# Altium schematic sheet RNG_SATA.SchDoc: RTM SATA
size 420 x 297 mm; Author: G.K.; CompanyName: WUT; DrawnBy: G.K.; Organization: CERN; Address1: Warsaw Univeristy of Technology; Address2: Nowowiejska 15/19; Revision: -; SheetNumber: -; SheetTotal: -; EDA_Number: ARTIQ; Projet: SINARA; ModifiedBy: -; CreateDate: XX/XX/XXXX; CheckedDate: -; Title2: adapter; DivGrp: ISE; Designer: G.K.; ModifiedDate: -; ProjectName: SINARA
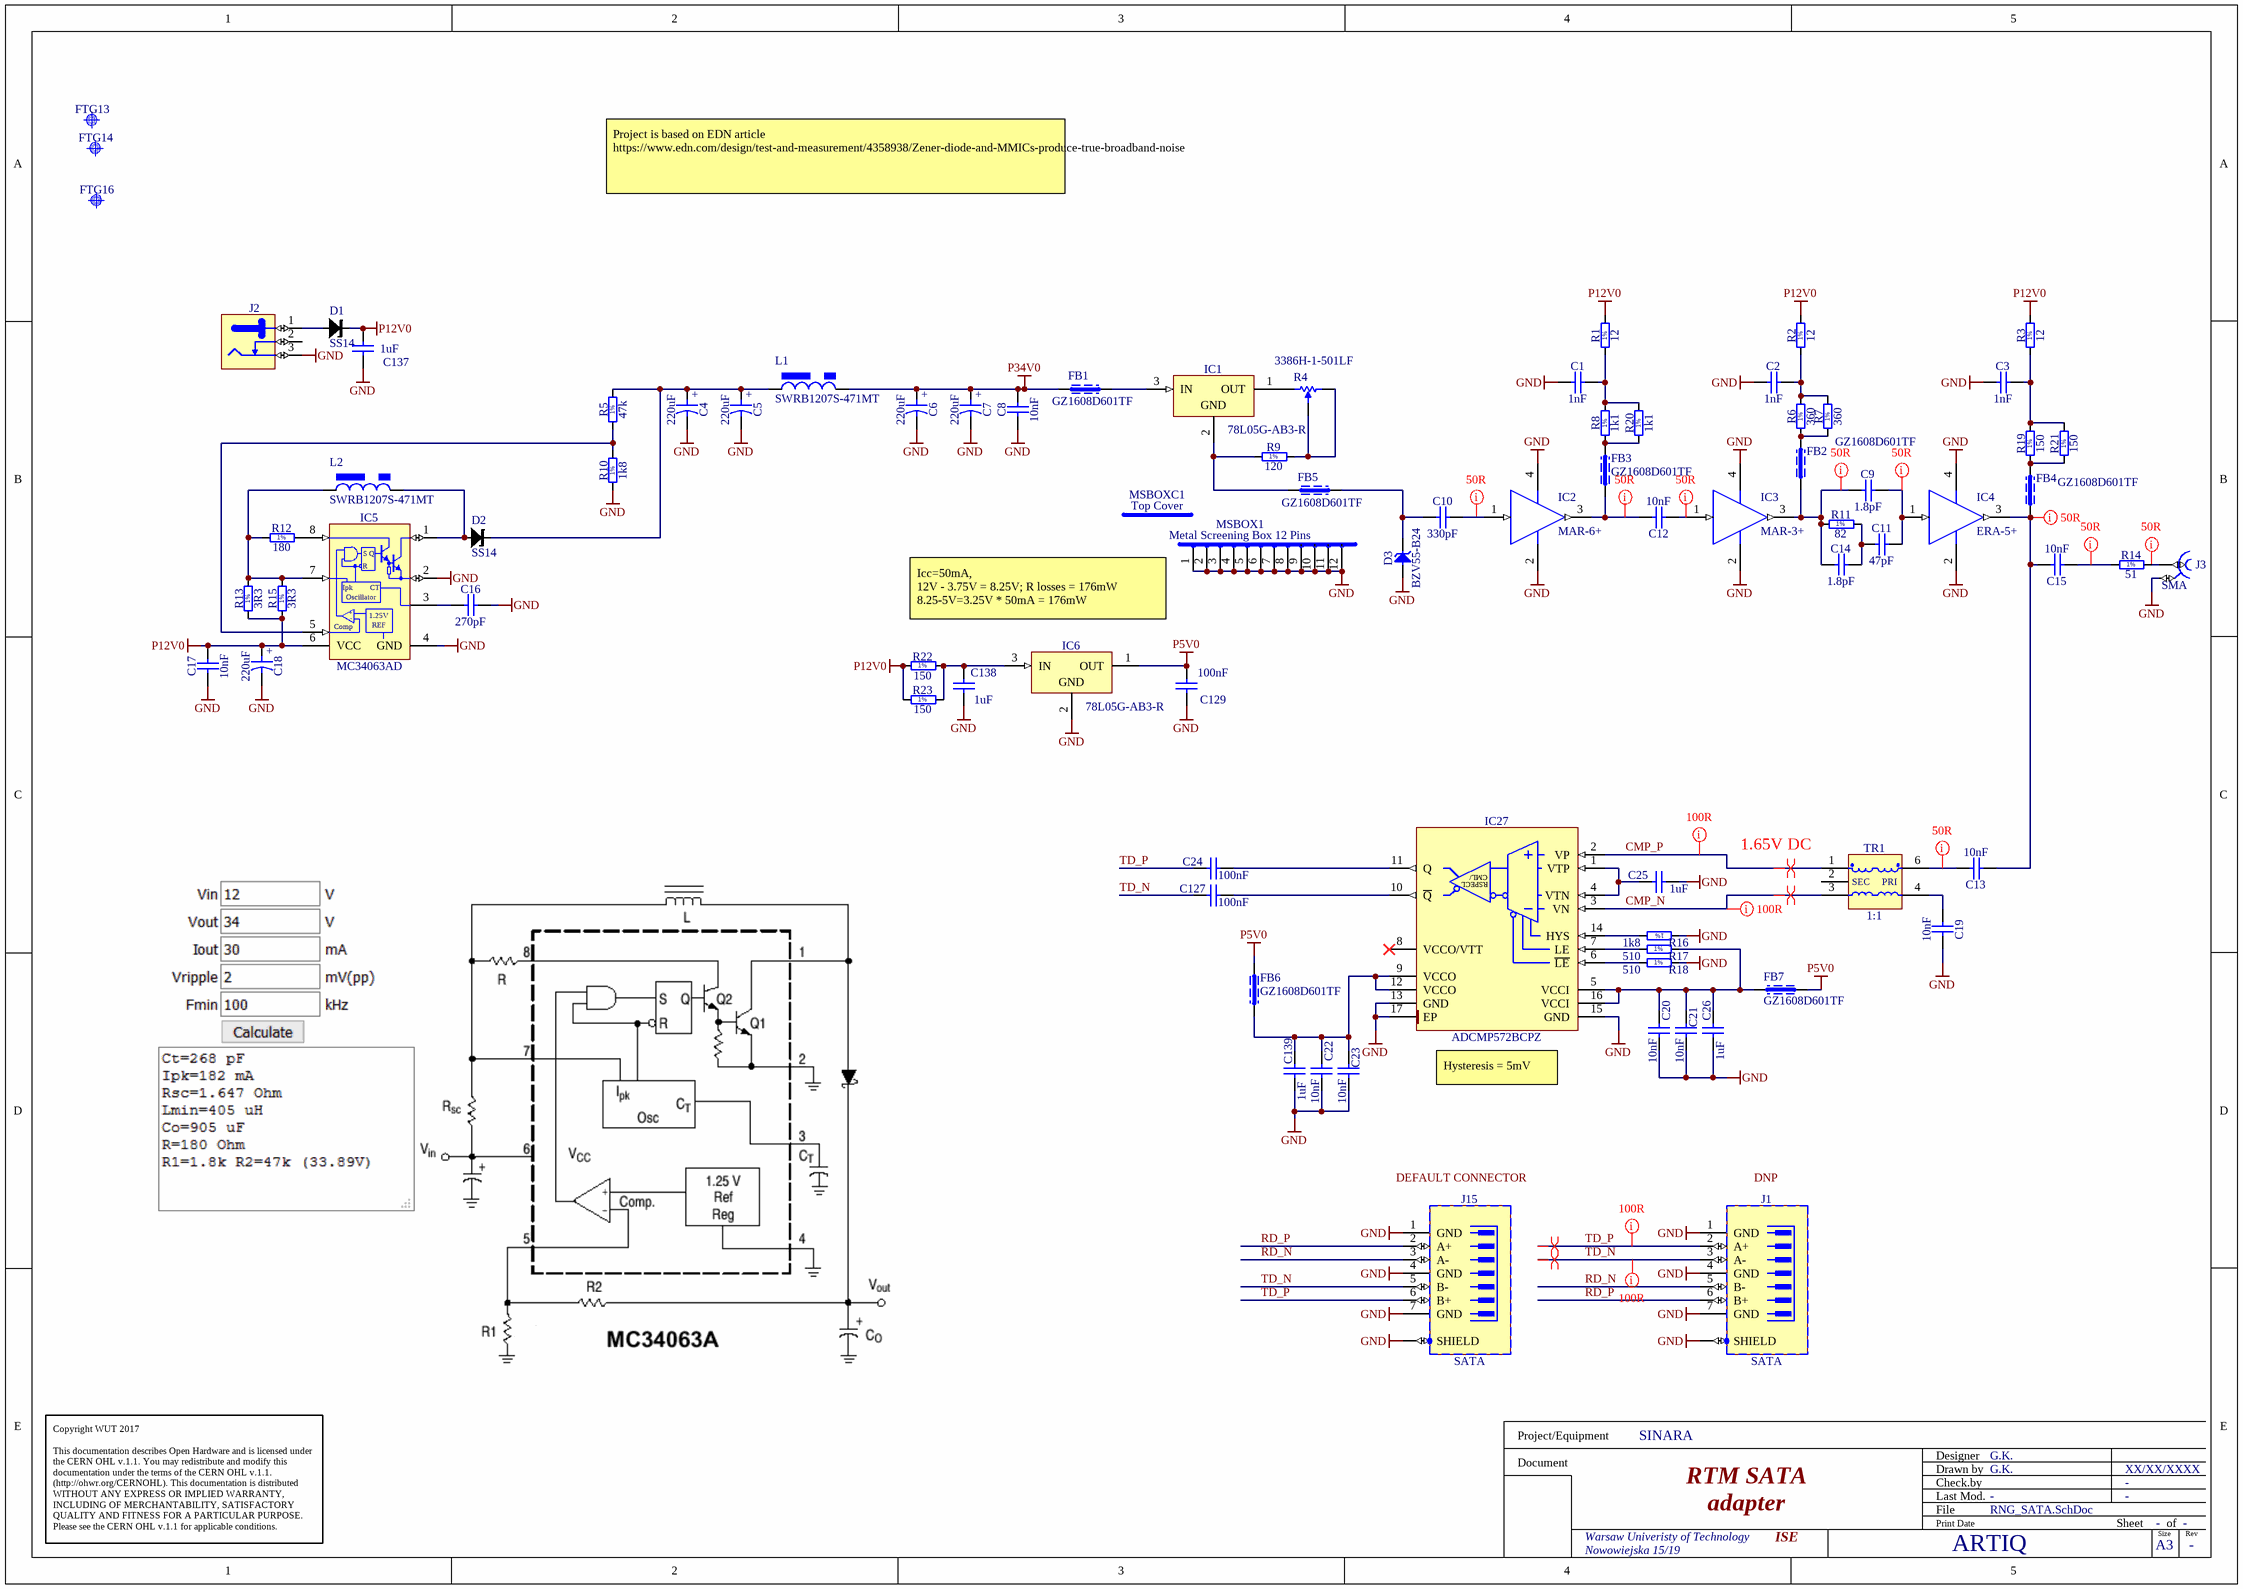
[diagram p0: RNG_SATA.SchDoc]

## Parts
C1  1nF  [CAPC1608X90N]
C2  1nF  [CAPC1608X90N]
C3  1nF  [CAPC1608X90N]
C4  220uF  [CAPAE830X1020N]
C5  220uF  [CAPAE830X1020N]
C6  220uF  [CAPAE830X1020N]
C7  220uF  [CAPAE830X1020N]
C8  10nF  [CAPC1608X87N]
C9  1.8pF  [CAPC1608X87N]
C10  330pF  [CAPC1608X87N]
C11  47pF  [CAPC1608X87N]
C12  10nF  [CAPC1608X87N]
C13  10nF  [CAPC1608X87N]
C14  1.8pF  [CAPC1608X87N]
C15  10nF  [CAPC1608X87N]
C16  270pF  [CAPC1608X87N]
C17  10nF  [CAPC1608X87N]
C18  220uF  [CAPAE830X1020N]
C19  10nF  [CAPC1608X87N]
C20  10nF  [CAPC1608X87N]
C21  10nF  [CAPC1608X87N]
C22  10nF  [CAPC1608X87N]
C23  10nF  [CAPC1608X87N]
C24  100nF  [CAPC1005X55N]
C25  1uF  [CAPC1608X87N]
C26  1uF  [CAPC1608X87N]
C127  100nF  [CAPC1005X55N]
C129  100nF  [CAPC1005X55N]
C137  1uF  [CAPC1608X87N]
C138  1uF  [CAPC1608X87N]
C139  1uF  [CAPC1608X87N]
D1  SS14  [DO-214AC/SMA]
D2  SS14  [DO-214AC/SMA]
D3  BZV55-B24  [DIOMELF3515N]
FB1  GZ1608D601TF  [0603L]
FB2  GZ1608D601TF  [0603L]
FB3  GZ1608D601TF  [0603L]
FB4  GZ1608D601TF  [0603L]
FB5  GZ1608D601TF  [0603L]
FB6  GZ1608D601TF  [0603L]
FB7  GZ1608D601TF  [0603L]
FTG13  Use only in PCB  [FIDUCIAL_TOP_C100-200]  (value not drawn)
FTG14  Use only in PCB  [FIDUCIAL_TOP_S100-200]  (value not drawn)
FTG16  Use only in PCB  [FIDUCIAL_TOP_S100-200]  (value not drawn)
IC1  78L05G-AB3-R  [SOT89]
IC2  MAR-6+  [MINI-CIRCUITS_VV105]
IC3  MAR-3+  [MINI-CIRCUITS_VV105]
IC4  ERA-5+  [MINI-CIRCUITS_VV105]
IC5  MC34063AD  [SOIC127P600X175-8N]
IC6  78L05G-AB3-R  [SOT89]
IC27  ADCMP572BCPZ  [QFN50P300X300X100-17N-S145]
J1  SATA  [3M_5607-4200-SH]
J2  Jack  [CLIFF_FC68148(DC-10A)]  (value not drawn)
J3  SMA  [RF249BT0050GHDW]
J15  SATA  [3M_5607-4200-SH]
L1  SWRB1207S-471MT  [choke_DLCSS124]
L2  SWRB1207S-471MT  [choke_DLCSS124]
MSBOX1  Metal Screening Box 12 Pins  [MSBOX_TE_2118728-2]
MSBOXC1  Top Cover  [MSBOX_TE_2118727-2]
R1  12  [RESC1608X55N]
R2  12  [RESC1608X55N]
R3  12  [RESC1608X55N]
R4  3386H-1-501LF  [BOUR-3386H]
R5  47k  [RESC1608X55N]
R6  360  [RESC2012X60N]
R7  360  [RESC2012X60N]
R8  1k1  [RESC1608X55N]
R9  120  [RESC1608X55N]
R10  1k8  [RESC1608X55N]
R11  82  [RESC1608X55N]
R12  180  [RESC1608X55N]
R13  3R3  [RESC2012X60N]
R14  51  [RESC1608X55N]
R15  3R3  [RESC2012X60N]
R16  1k8  [RESC1608X55N]
R17  510  [RESC1608X55N]
R18  510  [RESC1608X55N]
R19  150  [RESC2012X60N]
R20  1k1  [RESC1608X55N]
R21  150  [RESC2012X60N]
R22  150  [RESC2012X60N]
R23  150  [RESC2012X60N]
TR1  1:1  [XFMR_MINI-CIRCUITS_AT224]

## Nets
GND: C1.1 C2.1 C3.1 C4.2 C5.2 C6.2 C7.2 C8.1 C16.2 C17.1 C18.2 C19.2 C20.2 C21.2 C22.2 C23.2 C25.2 C26.1 C129.2 C137.1 C138.1 C139.1 D3.2(A) IC2.2(GND) IC2.4(GND) IC3.2(GND) IC3.4(GND) IC4.2(GND) IC4.4(GND) IC5.2(SWE) IC5.4(GND) IC6.2(GND) IC27.13(GND) IC27.15(GND) IC27.17(EP) J1.1(GND) J1.4(GND) J1.7(GND) J1.8(SHIELD) J2.3 J3.2 J15.1(GND) J15.4(GND) J15.7(GND) J15.8(SHIELD) MSBOX1.1 MSBOX1.2 MSBOX1.3 MSBOX1.4 MSBOX1.5 MSBOX1.6 MSBOX1.7 MSBOX1.8 MSBOX1.9 MSBOX1.10 MSBOX1.11 MSBOX1.12 R10.1 R16.1 R18.2
P5V0: C129.1 FB6.1 FB7.1 IC6.1(OUT)
P12V0: C17.2 C18.1 C137.2 D1.K IC5.6(VCC) R1.2 R2.2 R3.2 R13.1 R15.1 R22.1 R23.1
P34V0: C6.1 C7.1 C8.2 FB1.1 L1.2
CMP_N: IC27.3(VN) TR1.3(S)
CMP_P: IC27.2(VP) TR1.1(SDOT)
RD_N: J1.5(B-) J15.3(A-)
RD_P: J1.6(B+) J15.2(A+)
TD_N: C127.1 J1.3(A-) J15.5(B-)
TD_P: C24.2 J1.2(A+) J15.6(B+)
NetC1_2: C1.2 R1.1 R8.2 R20.2
NetC2_2: C2.2 R2.1 R6.2 R7.2
NetC3_2: C3.2 R3.1 R19.2 R21.2
NetC4_1: C4.1 C5.1 D2.K L1.1 R5.2
NetC9_1: C9.1 C14.1 FB2.1 IC3.3(RF_OUT) R11.1
NetC9_2: C9.2 C11.2 IC4.1(RF_IN)
NetC10_1: C10.1 D3.1(C) FB5.2
NetC10_2: C10.2 IC2.1(RF_IN)
NetC11_1: C11.1 C14.2 R11.2
NetC12_1: C12.1 IC3.1(RF_IN)
NetC12_2: C12.2 FB3.1 IC2.3(RF_OUT)
NetC13_1: C13.1 C15.2 FB4.1 IC4.3(RF_OUT)
NetC13_2: C13.2 TR1.6(PDOT)
NetC15_1: C15.1 R14.1
NetC16_1: C16.1 IC5.3(TC)
NetC19_1: C19.1 TR1.4(P)
NetC20_1: C20.1 C21.1 C26.2 FB7.2 IC27.5(VCCI) IC27.16(VCCI) R17.2
NetC22_1: C22.1 C23.1 C139.2 FB6.2 IC27.9(VCCO) IC27.12(VCCO)
NetC24_1: C24.1 IC27.11(Q)
NetC25_1: C25.1 IC27.1(VTP) IC27.4(VTN)
NetC127_2: C127.2 IC27.10(~{Q})
NetC138_2: C138.2 IC6.3(IN) R22.2 R23.2
NetD1_A: D1.A J2.1
NetD2_A: D2.A IC5.1(SWC) L2.2
NetFB1_2: FB1.2 IC1.3(IN)
NetFB2_2: FB2.2 R6.1 R7.1
NetFB3_2: FB3.2 R8.1 R20.1
NetFB4_2: FB4.2 R19.1 R21.1
NetFB5_1: FB5.1 IC1.2(GND) R9.1
NetIC1_1: IC1.1(OUT) R4.1
NetIC5_5: IC5.5(COMP) R5.1 R10.2
NetIC5_7: IC5.7(Ipk) L2.1 R12.1 R13.2 R15.2
NetIC5_8: IC5.8(DRVC) R12.2
NetIC27_6: IC27.6(~{LE}) R18.1
NetIC27_7: IC27.7(LE) R17.1
NetIC27_14: IC27.14(HYS) R16.2
NetJ3_1: J3.1 R14.2
NetR4_2: R4.2 R4.3 R9.2

Not connected (* = marked no-connect by the designer): IC27 8(VCCO/VTT)*; J2 2; TR1 2(NC)

## Layout directives
net class Z50R: NetC9_1, NetC9_2, NetC10_2, NetC12_1, NetC12_2, NetC13_1, NetC13_2, NetC15_1, NetJ3_1
net class Z100R: CMP_N, CMP_P, TD_N, TD_P
differential pair: CMP_N, CMP_P, TD_N, TD_P

## Notes on the sheet
- Project is based on EDN article
  https://www.edn.com/design/test-and-measurement/4358938/Zener-diode-and-MMICs-produce-true-broadband-noise
- Icc=50mA,
  12V - 3.75V = 8.25V; R losses = 176mW
  8.25-5V=3.25V * 50mA = 176mW
- (near TR1) 1.65V DC
- (near IC27) Hysteresis = 5mV
- Copyright WUT 2017
  This documentation describes Open Hardware and is licensed under the CERN OHL v.1.1. You may redistribute and modify this documentation under the terms of the CERN OHL v.1.1. (http://ohwr.org/CERNOHL). This documentation is distributed WITHOUT ANY EXPRESS OR IMPLIED WARRANTY, INCLUDING OF MERCHANTABILITY, SATISFACTORY QUALITY AND FITNESS FOR A PARTICULAR PURPOSE. Please see the CERN OHL v.1.1 for applicable conditions.
- Labels drawn without touching a wire or pin: DEFAULT CONNECTOR, DNP
- Project/Equipment
- Document
- Designer
- Drawn by
- Check.by
- File
- Last Mod.
- Print Date
- Sheet
- Size
- A3
- of
- Rev
- (in symbol ADCMP573BCPZ) CML/; RSPECL
- (in symbol CAE830-1020_220UF_35V_20%) +
- (in symbol MC34063AD) S; Q; R; CT; Oscillator; +; -; 1.25V; Comp; REF
- (in symbol R0603_1K1_1%_0.1W_100PPM) 1%
- (in symbol R0603_1K8_1%_0.1W_100PPM) 1%
- (in symbol R0603_12R_1%_0.1W_100PPM) 1%
- (in symbol R0603_47K_1%_0.1W_100PPM) 1%
- (in symbol R0603_51R_1%_0.1W_100PPM) 1%
- (in symbol R0603_82R_1%_0.1W_100PPM) 1%
- (in symbol R0603_120R_1%_0.1W_100PPM) 1%
- (in symbol R0603_180R_1%_0.1W_100PPM) 1%
- (in symbol R0603_510R_1%_0.1W_100PPM) 1%
- (in symbol R0805_3R3_1%_0.125W_200PPM) 1%
- (in symbol R0805_150R_1%_0.125W_100PPM) 1%
- (in symbol R0805_360R_1%_0.125W_100PPM) 1%
- (in symbol XFMR_MINI-CIRCUITS_TC1-1-13M+) SEC; PRI

## Library data of the parts
C1-C3 = CC0603_1NF_50V_1%_NP0: Non-polarised capacitor; Part Description: SMD Multilayer Chip Ceramic Capacitor; Manufacturer: GENERIC; Manufacturer1 Part Number: 06035A102FAT2A; Voltage: 50V; TC: C0G/NP0; Tolerance: ±1%; Part Number: CC0603_1NF_50V_1%_NP0; Component Kind: Standard; Component Type: Standard; Pin Count: 2; Value: 1nF; Status: None; Manufacturer Part Number: CC0603_1NF_50V_1%_NP0; Case: 0603; Mounted: Yes; Socket: No; SMD: Yes; Sense: No; Manufacturer1 Example: AVX; Manufacturer1 ComponentHeight: 0.9mm; HelpURL: \\cern.ch\dfs\Applications\Altium\Datasheets\CC0603_C0G_AVX.pdf; Author: CERN DEM JLC; CreateDate: 15.06.2017; LatestRevisionDate: 15.06.2017
C4-C7 C18 = CAE830-1020_220UF_35V_20%: Polarised capacitor; Part Description: Aluminum Electrolytic SMT Capacitor; Manufacturer: PANASONIC; Manufacturer Part Number: EEEFK1V221AP; Voltage: 35V; Tolerance: ±20%; Part Number: CAE830-1020_220UF_35V_20%; Component Kind: Standard; Component Type: Standard; Pin Count: 2; Value: 220uF; Status: Not Recommended; Case: F; Mounted: Yes; Socket: No; SMD: Yes; Sense: No; ComponentHeight: 10.2mm; HelpURL: \\cern.ch\dfs\Applications\Altium\Datasheets\CAE_PANASONIC_FK.pdf; Author: CERN DEM JLC; CreateDate: 03.12.2007; LatestRevisionDate: 05.11.2014
C8 C12 C13 C15 C17 C19-C23 = CC0603_10NF_50V_5%_C0G: Non-polarised capacitor; Part Description: SMD Multilayer Chip Ceramic Capacitor; Manufacturer: GENERIC; Manufacturer1 Part Number: C1608C0G1H103J080AA; Voltage: 50V; TC: C0G/NP0; Tolerance: ±5%; Part Number: CC0603_10NF_50V_5%_C0G; Component Kind: Standard; Component Type: Standard; Pin Count: 2; Value: 10nF; Status: Preferred; Manufacturer Part Number: CC0603_10NF_50V_5%_C0G; Case: 0603; Mounted: Yes; Socket: No; SMD: Yes; Sense: No; Manufacturer1 Example: TDK; Manufacturer1 ComponentHeight: 0.9mm; HelpURL: \\cern.ch\dfs\Applications\Altium\Datasheets\CC0603_C0G_TDK_C.pdf; Author: CERN DEM JLC; CreateDate: 10.12.2014; LatestRevisionDate: 10.12.2014
C9 C14 = CC0603_1.8PF_50V_0.25PF_NP0: Non-polarised capacitor; Part Description: SMD Multilayer Chip Ceramic Capacitor; Manufacturer: GENERIC; Manufacturer1 Part Number: 223886715188; Voltage: 50V; TC: C0G/NP0; Tolerance: ±0.25pF; Part Number: CC0603_1.8PF_50V_0.25PF_NP0; Component Kind: Standard; Component Type: Standard; Pin Count: 2; Value: 1.8pF; Status: Preferred; Manufacturer Part Number: CC0603_1.8PF_50V_0.25PF_NP0; Case: 0603; Mounted: Yes; Socket: No; SMD: Yes; Sense: No; Manufacturer1 Example: PHYCOMP; Manufacturer1 ComponentHeight: 0.87mm; HelpURL: \\cern.ch\dfs\Applications\Altium\Datasheets\CC0603_NP0_PHYCOMP.pdf; Author: CERN DEM JLC; CreateDate: 03.12.2007; LatestRevisionDate: 03.12.2007
C10 = CC0603_330PF_50V_5%_NP0: Non-polarised capacitor; Part Description: SMD Multilayer Chip Ceramic Capacitor; Manufacturer: GENERIC; Manufacturer1 Part Number: 223886715331; Voltage: 50V; TC: C0G/NP0; Tolerance: ±5%; Part Number: CC0603_330PF_50V_5%_NP0; Component Kind: Standard; Component Type: Standard; Pin Count: 2; Value: 330pF; Status: Preferred; Manufacturer Part Number: CC0603_330PF_50V_5%_NP0; Case: 0603; Mounted: Yes; Socket: No; SMD: Yes; Sense: No; Manufacturer1 Example: PHYCOMP; Manufacturer1 ComponentHeight: 0.87mm; HelpURL: \\cern.ch\dfs\Applications\Altium\Datasheets\CC0603_NP0_PHYCOMP.pdf; Author: CERN DEM JLC; CreateDate: 03.12.2007; LatestRevisionDate: 03.12.2007
C11 = CC0603_47PF_50V_5%_NP0: Non-polarised capacitor; Part Description: SMD Multilayer Chip Ceramic Capacitor; Manufacturer: GENERIC; Manufacturer1 Part Number: 223886715479; Voltage: 50V; TC: C0G/NP0; Tolerance: ±5%; Part Number: CC0603_47PF_50V_5%_NP0; Component Kind: Standard; Component Type: Standard; Pin Count: 2; Value: 47pF; Status: Preferred; Manufacturer Part Number: CC0603_47PF_50V_5%_NP0; Case: 0603; Mounted: Yes; Socket: No; SMD: Yes; Sense: No; Manufacturer1 Example: PHYCOMP; Manufacturer1 ComponentHeight: 0.87mm; HelpURL: \\cern.ch\dfs\Applications\Altium\Datasheets\CC0603_NP0_PHYCOMP.pdf; Author: CERN DEM JLC; CreateDate: 03.12.2007; LatestRevisionDate: 03.12.2007
C16 = CC0603_270PF_50V_5%_NP0: Non-polarised capacitor; Part Description: SMD Multilayer Chip Ceramic Capacitor; Manufacturer: GENERIC; Manufacturer1 Part Number: 223886715271; Voltage: 50V; TC: C0G/NP0; Tolerance: ±5%; Part Number: CC0603_270PF_50V_5%_NP0; Component Kind: Standard; Component Type: Standard; Pin Count: 2; Value: 270pF; Status: Preferred; Manufacturer Part Number: CC0603_270PF_50V_5%_NP0; Case: 0603; Mounted: Yes; Socket: No; SMD: Yes; Sense: No; Manufacturer1 Example: PHYCOMP; Manufacturer1 ComponentHeight: 0.87mm; HelpURL: \\cern.ch\dfs\Applications\Altium\Datasheets\CC0603_NP0_PHYCOMP.pdf; Author: CERN DEM JLC; CreateDate: 03.12.2007; LatestRevisionDate: 03.12.2007
C24 C127 C129 = CC0402_100NF_16V_10%_X7R: Non-polarised capacitor; Part Description: SMD Multilayer Chip Ceramic Capacitor; Manufacturer: GENERIC; Manufacturer1 Part Number: GRM155R71C104KA88D; Voltage: 16V; TC: X7R; Tolerance: ±10%; Table: Capacitors SMD; Part Number: CC0402_100NF_16V_10%_X7R; Component Kind: Standard; Component Type: Standard; Pin Count: 2; Value: 100nF; Status: Not Recommended; Manufacturer Part Number: CC0402_100NF_16V_10%_X7R; Case: 0402; Mounted: Yes; Socket: No; SMD: Yes; Manufacturer1 Example: MURATA; Manufacturer1 ComponentHeight: 0.55mm; HelpURL: \\cern.ch\dfs\Applications\Altium\Datasheets\CC0402_X7R_MURATA_GRM.pdf; Author: CERN DEM JLC; CreateDate: 05/12/2013; LatestRevisionDate: 03/12/2007
C25 C26 C137-C139 = CC0603_1UF_16V_10%_X7R: Non-polarised capacitor; Part Description: SMD Multilayer Chip Ceramic Capacitor; Manufacturer: GENERIC; Manufacturer1 Part Number: 223824613663; Voltage: 16V; TC: X7R; Tolerance: ±10%; Table: Capacitors SMD; Part Number: CC0603_1UF_16V_10%_X7R; Component Kind: Standard; Component Type: Standard; Pin Count: 2; Value: 1uF; Status: Preferred; Manufacturer Part Number: CC0603_1uF_16V_10%_X7R; Case: 0603; Mounted: Yes; Socket: No; SMD: Yes; Manufacturer1 Example: PHYCOMP; Manufacturer1 ComponentHeight: 0.87mm; HelpURL: \\cern.ch\dfs\Applications\Altium\Datasheets\CC0805_X5R_PHYCOMP_HC.pdf; Author: CERN DEM JLC; CreateDate: 03/12/2007; LatestRevisionDate: 03/12/2007
D1 D2 = D_SS14: 1A 80V shottky diode (Maritex); Supplier 1: Digi-Key; Supplier Part Number 1: SS14-E3/5ATGITR-ND
D3 = BZV55-B24: Zener Diode; Part Description: Voltage Regulator Diode; Manufacturer: NEXPERIA; Voltage: 24V; Power: 500mW; PressFit: No; Bonding: No; Part Number: BZV55-B24; Component Kind: Standard; Component Type: Standard; Device: BZV55-B24; PackageDescription: SOD80C, MELF Diode, 2-Leads, Body 3.5x1.5mm, IPC Medium Density; Manufacturer Part Number: BZV55-B24; Pin Count: 2; Case: SOD-80C; Mounted: Yes; Socket: No; SMD: Yes; Sense: No; ComponentHeight: 1.6mm; HelpURL: \\cern.ch\dfs\Applications\Altium\Datasheets\BZV55.pdf; Author: CERN DEM JLC; CreateDate: 15.10.2008; LatestRevisionDate: 22.01.2018
FB1-FB7 = L_FERRITE_BEAD_0603: ferrite bead 100R@100MHz 1A; Supplier 1: Newark; Supplier Part Number 1: 89R3144
FTG13 = FIDUCIAL_TARGET_C100-200: Fiducial Target; Part Description: Round Fiducial Target, Top Layer, 1.0mm, Top Solder 2.0mm, Keepout =2.0mm; Mounted: No; Part Number: FIDUCIAL_TARGET_C100-200; Component Kind: Standard (No BOM); Component Type: Standard (No BOM); Pin Count: 1; Family: Fiducial; Socket: No; SMD: Yes; Sense: No; Status: None; ComponentHeight: 0mm; HelpURL: Undefined; Author: CERN DEM JLC; CreateDate: 09.02.2010; LatestRevisionDate: 04.04.2012; PackageDescription: Round Fiducial Target, Top Layer, 1.0mm, Top Solder 2.0mm, Keepout =2.0mm
FTG14 FTG16 = FIDUCIAL_TARGET_S100-200: Fiducial Target; Part Description: Square Fiducial Target, Top Layer, 1.0mm, Top Solder 2.0mm, Keepout =2.0mm; Mounted: No; Part Number: FIDUCIAL_TARGET_S100-200; Component Kind: Standard (No BOM); Component Type: Standard (No BOM); Pin Count: 1; Family: Fiducial; Socket: No; SMD: Yes; Sense: No; Status: None; ComponentHeight: 0mm; HelpURL: Undefined; Author: CERN DEM JLC; CreateDate: 09.02.2010; LatestRevisionDate: 04.04.2012; PackageDescription: Square Fiducial Target, Top Layer, 1.0mm, Top Solder 2.0mm, Keepout =2.0mm
IC1 IC6 = L78L05ACUTR: 3-Terminal Regulator 1=OUT 2=GND 3=IN; Part Description: 5V 100mA Positive Voltage Regulator; Manufacturer: ST MICROELECTRONICS; PressFit: No; Bonding: No; Part Number: L78L05ACUTR; Component Kind: Standard; Component Type: Standard; Device: L78L05ACUTR; PackageDescription: SOT89-3, 3-Leads, Body 2.44x4.5mm; Manufacturer Part Number: L78L05ACUTR; Pin Count: 4; Case: SOT89; Mounted: Yes; Socket: No; SMD: Yes; Sense: No; ComponentHeight: 1.6mm; HelpURL: \\cern.ch\dfs\Applications\Altium\Datasheets\L78L05ACUTR.pdf; Author: CERN DEM JLC; CreateDate: 10.10.2011; LatestRevisionDate: 06.12.2011
IC2 = RF_MAR-6+: Monolithic Amplifier DC-2GHz; Part Description: DC-2GHz Monolithic Amplifier; Manufacturer: MINI-CIRCUITS; PressFit: No; Bonding: No; Part Number: MAR-6+; Component Kind: Standard; Component Type: Standard; Device: MAR-6+; PackageDescription: MINI-CIRCUITS VV105 Case, Body 2.16mm Diameter X 1.22mm H; Manufacturer Part Number: MAR-6+; Pin Count: 4; Mounted: Yes; Socket: No; SMD: Yes; Sense: No; ComponentHeight: 1.22mm; Author: CERN DEM MR; HelpURL: \\cern.ch\dfs\Applications\Altium\Datasheets\ERA-3+.pdf; CreateDate: 02.10.2017; LatestRevisionDate: 02.10.2017
IC3 = RF_MAR-3+: Monolithic Amplifier DC-2GHz; Part Description: DC-2GHz Monolithic Amplifier; Manufacturer: MINI-CIRCUITS; PressFit: No; Bonding: No; Part Number: MAR-3+; Component Kind: Standard; Component Type: Standard; Device: MAR-3+; PackageDescription: MINI-CIRCUITS VV105 Case, Body 2.16mm Diameter X 1.22mm H; Manufacturer Part Number: MAR-3+; Pin Count: 4; Mounted: Yes; Socket: No; SMD: Yes; Sense: No; ComponentHeight: 1.22mm; Author: CERN DEM MR; HelpURL: \\cern.ch\dfs\Applications\Altium\Datasheets\ERA-3+.pdf; CreateDate: 02.10.2017; LatestRevisionDate: 02.10.2017
IC4 = RF_ERA-5+: Monolithic Amplifier DC-4GHz; Part Description: DC-4GHz Monolithic Amplifier; Manufacturer: MINI-CIRCUITS; PressFit: No; Bonding: No; Part Number: ERA-5+; Component Kind: Standard; Component Type: Standard; Device: ERA-5+; PackageDescription: MINI-CIRCUITS VV105 Case, Body 2.16mm Diameter X 1.22mm H; Manufacturer Part Number: ERA-5+; Pin Count: 4; Mounted: Yes; Socket: No; SMD: Yes; Sense: No; ComponentHeight: 1.22mm; Author: CERN DEM MR; HelpURL: \\cern.ch\dfs\Applications\Altium\Datasheets\ERA-3+.pdf; CreateDate: 02.10.2017; LatestRevisionDate: 02.10.2017
IC5 = MC34063AD: 3V to 40V 1.5A Peak Boost/Buck/Inverting Switching Regulator; Manufacturer: TEXAS INSTRUMENTS; PressFit: No; Bonding: No; Part Number: MC34063AD; Component Kind: Standard; Component Type: Standard; Device: MC34063AD; PackageDescription: SOIC 8, Pitch 1.27mm, Body 4x5mm, IPC Medium Density; Part Description: 3V to 40V 1.5A Peak Boost/Buck/Inverting Switching Regulator; Manufacturer Part Number: MC34063AD; Pin Count: 8; Case: SOIC8; Mounted: Yes; Socket: No; SMD: Yes; Sense: No; ComponentHeight: 1.75mm; HelpURL: \\cern.ch\dfs\Applications\Altium\Datasheets\MC34063AD.pdf; Author: CERN DEM JLC; CreateDate: 27.10.2009; LatestRevisionDate: 27.10.2009
IC27 = ADCMP573BCPZ: Ultrafast 3.3V/5V Single-Supply SiGe Comparator; Manufacturer: ANALOG DEVICES; Table: Operational Amplifiers; Part Number: ADCMP572BCPZ; Component Kind: Standard; Component Type: Standard; Device: ADCMP572BCPZ; PackageDescription: QFN,0.50mm Pitch, Square; 4 Pin X 4 Pin, 3mm X 3mm X 1.00mm H Body (w/Thermal Tab 1.45 X 1.45mm), IPC Medium Density; Part Description: Ultrafast 3.3V/5V Single-Supply SiGe Comparator; Manufacturer Part Number: ADCMP572BCPZ; Pin Count: 17; Case: QFN16; Mounted: Yes; Socket: No; SMD: Yes; ComponentHeight: 1.0mm; Author: CERN DEM JLC; HelpURL: \\cern.ch\dfs\Applications\Altium\Datasheets\ADCMP573BCPZ.pdf; CreateDate: 17/07/2014; LatestRevisionDate: 18/07/2014
J1 J15 = 3M_5607-4200-SH: 7 Pin + 1 Shield SATA Receptacle; Part Description: Signal Plug, Surfacemount, Right Angle,  Serial Advanced Technology Attachment (SATA) Connector, 5607 Series; Manufacturer: 3M; PressFit: No; Part Number: 3M_5607-4200-SH; Component Kind: Standard; Component Type: Standard; Pin Count: 8; Family: SATA; Mounted: Yes; Socket: No; SMD: Yes; Sense: No; Status: None; Manufacturer Part Number: 5607-4200-SH; ComponentHeight: 4mm; HelpURL: \\cern.ch\dfs\Applications\Altium\Datasheets\3M_5607-4200-SH.pdf; Author: CERN DEM JLC; CreateDate: 14.02.2011; LatestRevisionDate: 31.05.2011
J2 = CLIFF_FC68148(DC-10A): 12V /  5A, 2.1mm Diameter Pin, DC Power Socket With  Switch. DC10A Type; Part Description: 12V/5A, 2.1mm Diameter Pin, DC Power Socket With  Switch (DC10A Type); Manufacturer: CLIFF ELECTRONIC COMPONENTS; PressFit: No; Part Number: CLIFF_FC68148(DC-10A); Component Kind: Standard; Component Type: Standard; Pin Count: 3; Family: Jack; Mounted: Yes; Socket: No; SMD: No; Sense: No; Status: None; Manufacturer Part Number: FC68148 (DC-10A); ComponentHeight: 11mm; HelpURL: \\cern.ch\dfs\Applications\Altium\Datasheets\CLIFF_FC68148(DC-10A).pdf; Author: CERN DEM JLC; CreateDate: 23.11.2010; LatestRevisionDate: 23.11.2010
J3 = CON_SMA_RF249BT0050GHDW: 50 Ohm Through Hole SMA Right Angle PCB Jack; Part Number: AdamTech_RF249BT0050GHDW; Manufacturer: AdamTech; PressFit: No; Component Kind: Standard; Component Type: Standard; Pin Count: 5; Family: SMA; Mounted: Yes; Socket: No; SMD: No; Sense: No; Status: None; Part Description: 50 Ohm Through Hole SMA Right Angle PCB Jack; Manufacturer Part Number: RF249BT0050GHDW; ComponentHeight: 10.44mm; HelpURL: \\cern.ch\dfs\Applications\Altium\Datasheets\AMPHENOL_132203.pdf; Author: GK; CreateDate: 06.10.2016; LatestRevisionDate: 06.10.2016
L1 L2 = L_POWER_CSS124: inductor; Supplier 1: Farnell; Supplier Part Number 1: 1864453
MSBOX1 = SH_TE_2118728-2: Part Description: Frame of Standard Surface Mount Shield (Two Piece), External Dimensions 16.5 x 16.5mm; Manufacturer: Tyco Electronics; Manufacturer Part Number: BMI-S-202-F; PressFit: No; Part Number: MSBOX_TE_2118728-2; Component Kind: Standard; Component Type: Standard; Pin Count: 12; PackageDescription: Frame of Standard Surface Mount Shield (Two Piece), External Dimensions 16.5 x 16.5mm; Mounted: Yes; Socket: No; SMD: Yes; Sense: No; Status: None; ComponentHeight: 7; HelpURL: \\cern.ch\dfs\Applications\Altium\Datasheets\MSBOX_LAIRD_BMI-S-202-F.pdf; Author: GK; CreateDate: 15.06.2017; LatestRevisionDate: 15.06.2017
MSBOXC1 = SH_TE_2118727-2: Metal Screening Box - Top Cover 0 Pin; Part Description: Cover for Frame of Standard Surface Mount Shield (Two Piece), External Dimensions 16.5 x 16.5mm; Manufacturer: Tyco Electronics; PressFit: No; Part Number: MSBOX_TE_2118727-2; Component Kind: Standard; Component Type: Standard; Pin Count: 0; PackageDescription: Cover for Frame of Standard Surface Mount Shield (Two Piece), External Dimensions 16.5 x 16.5mm; Mounted: Yes; Socket: No; SMD: Yes; Sense: No; Status: None; Manufacturer Part Number: 2118727-2; ComponentHeight: 2mm; HelpURL: \\cern.ch\dfs\Applications\Altium\Datasheets\MSBOX_LAIRD_BMI-S-202-C.pdf; Author: GK; CreateDate: 15.06.2017; LatestRevisionDate: 15.06.2017
R1-R3 = R0603_12R_1%_0.1W_100PPM: Resistor - 1%; Part Description: General Purpose Thick Film Chip Resistor; Manufacturer: GENERIC; Manufacturer1 Part Number: NRC06F12R0TRF; Power: 0.1W; TC: ±100ppm/°C; PressFit: No; Part Number: R0603_12R_1%_0.1W_100PPM; Component Kind: Standard; Component Type: Standard; Pin Count: 2; Value: 12; Status: Preferred; Tolerance: ±1%; Manufacturer Part Number: R0603_12R_1%_0.1W_100PPM; Case: 0603; Mounted: Yes; Sense: No; Socket: No; SMD: Yes; Manufacturer1 Example: NIC COMPONENT; Manufacturer1 ComponentHeight: 0.55mm; HelpURL: \\cern.ch\dfs\Applications\Altium\Datasheets\R0603_NIC_NRC.pdf; Author: CERN DEM JLC; CreateDate: 03.12.2007; LatestRevisionDate: 13.03.2008
R4 = CMP-2000-05591-1: Square Trimpot(R) Trimming Potentiometer, 500 Ohm, +/- 10%, 0.5 W, -55 to 125 degC, 3-Pin THD, RoHS, Tube; Manufacturer: Bourns; Product Weight: 0.85g; Resistance Value: 500Ohm; Shaft Diameter: 3.15mm; Number of Turns: 1(Elec),1(Mech)Turns; Power Rating: 0.5(1/2)W; Linear Or Logarithmic: Lin; COO: CR; Temperature Coefficient: 100ppm/C; Package Reference: 3386H; Datasheet Version: 05/2016; Dimension: 9.53x4.83x9.53mm; Military Standard: N/R; Failure Rate: N/R; Mounting: ThroughHole; Supplier: Bourns; Termination Style: Pin; Tolerance: 10%; Package Description: 3-Pin Through Hole Device, Body 9.53 x 4.83 mm, Pitch 2.54 mm; Part No: 3386H-1-501LF; Type: Trimmer; Packaging: Tube; Family: 3386; Technology: Cermet; Operating Temperature: -55to125C; Mounting Technology: ThroughHole; Supplier Standard Pack: 50; RoHS: Yes; Manufacturer URL: http://www.bourns.com/; Datasheet URL: http://www.bourns.com/docs/Product-Datasheets/3386.pdf; HTS: 8533408050; ECCN: EAR99
R5 = R0603_47K_1%_0.1W_100PPM: Resistor - 1%; Part Description: General Purpose Thick Film Chip Resistor; Manufacturer: GENERIC; Manufacturer1 Part Number: NRC06F4702TRF; Power: 0.1W; TC: ±100ppm/°C; PressFit: No; Part Number: R0603_47K_1%_0.1W_100PPM; Component Kind: Standard; Component Type: Standard; Pin Count: 2; Value: 47k; Status: Preferred; Tolerance: ±1%; Manufacturer Part Number: R0603_47K_1%_0.1W_100PPM; Case: 0603; Mounted: Yes; Sense: No; Socket: No; SMD: Yes; Manufacturer1 Example: NIC COMPONENT; Manufacturer1 ComponentHeight: 0.55mm; HelpURL: \\cern.ch\dfs\Applications\Altium\Datasheets\R0603_NIC_NRC.pdf; Author: CERN DEM JLC; CreateDate: 03.12.2007; LatestRevisionDate: 13.03.2008
R6 R7 = R0805_360R_1%_0.125W_100PPM: Resistor - 1%; Part Description: General Purpose Thick Film Chip Resistor; Manufacturer: GENERIC; Manufacturer1 Part Number: NRC10F3600TRF; Power: 0.125W; TC: ±100ppm/°C; PressFit: No; Part Number: R0805_360R_1%_0.125W_100PPM; Component Kind: Standard; Component Type: Standard; Pin Count: 2; Value: 360; Status: Preferred; Tolerance: ±1%; Manufacturer Part Number: R0805_360R_1%_0.125W_100PPM; Case: 0805; Mounted: Yes; Sense: No; Socket: No; SMD: Yes; Manufacturer1 Example: NIC COMPONENT; Manufacturer1 ComponentHeight: 0.6mm; HelpURL: \\cern.ch\dfs\Applications\Altium\Datasheets\R0805_NIC_NRC.pdf; Author: CERN DEM JLC; CreateDate: 03.12.2007; LatestRevisionDate: 13.03.2008
R8 R20 = R0603_1K1_1%_0.1W_100PPM: Resistor - 1%; Part Description: General Purpose Thick Film Chip Resistor; Manufacturer: GENERIC; Manufacturer1 Part Number: NRC06F1101TRF; Power: 0.1W; TC: ±100ppm/°C; PressFit: No; Part Number: R0603_1K1_1%_0.1W_100PPM; Component Kind: Standard; Component Type: Standard; Pin Count: 2; Value: 1k1; Status: Preferred; Tolerance: ±1%; Manufacturer Part Number: R0603_1K1_1%_0.1W_100PPM; Case: 0603; Mounted: Yes; Sense: No; Socket: No; SMD: Yes; Manufacturer1 Example: NIC COMPONENT; Manufacturer1 ComponentHeight: 0.55mm; HelpURL: \\cern.ch\dfs\Applications\Altium\Datasheets\R0603_NIC_NRC.pdf; Author: CERN DEM JLC; CreateDate: 03.12.2007; LatestRevisionDate: 13.03.2008
R9 = R0603_120R_1%_0.1W_100PPM: Resistor - 1%; Part Description: General Purpose Thick Film Chip Resistor; Manufacturer: GENERIC; Manufacturer1 Part Number: NRC06F1200TRF; Power: 0.1W; TC: ±100ppm/°C; PressFit: No; Part Number: R0603_120R_1%_0.1W_100PPM; Component Kind: Standard; Component Type: Standard; Pin Count: 2; Value: 120; Status: Preferred; Tolerance: ±1%; Manufacturer Part Number: R0603_120R_1%_0.1W_100PPM; Case: 0603; Mounted: Yes; Sense: No; Socket: No; SMD: Yes; Manufacturer1 Example: NIC COMPONENT; Manufacturer1 ComponentHeight: 0.55mm; HelpURL: \\cern.ch\dfs\Applications\Altium\Datasheets\R0603_NIC_NRC.pdf; Author: CERN DEM JLC; CreateDate: 03.12.2007; LatestRevisionDate: 13.03.2008
R10 R16 = R0603_1K8_1%_0.1W_100PPM: Resistor - 1%; Part Description: General Purpose Thick Film Chip Resistor; Manufacturer: GENERIC; Manufacturer1 Part Number: NRC06F1801TRF; Power: 0.1W; TC: ±100ppm/°C; PressFit: No; Part Number: R0603_1K8_1%_0.1W_100PPM; Component Kind: Standard; Component Type: Standard; Pin Count: 2; Value: 1k8; Status: Preferred; Tolerance: ±1%; Manufacturer Part Number: R0603_1K8_1%_0.1W_100PPM; Case: 0603; Mounted: Yes; Sense: No; Socket: No; SMD: Yes; Manufacturer1 Example: NIC COMPONENT; Manufacturer1 ComponentHeight: 0.55mm; HelpURL: \\cern.ch\dfs\Applications\Altium\Datasheets\R0603_NIC_NRC.pdf; Author: CERN DEM JLC; CreateDate: 03.12.2007; LatestRevisionDate: 13.03.2008
R11 = R0603_82R_1%_0.1W_100PPM: Resistor - 1%; Part Description: General Purpose Thick Film Chip Resistor; Manufacturer: GENERIC; Manufacturer1 Part Number: NRC06F82R0TRF; Power: 0.1W; TC: ±100ppm/°C; PressFit: No; Part Number: R0603_82R_1%_0.1W_100PPM; Component Kind: Standard; Component Type: Standard; Pin Count: 2; Value: 82; Status: Preferred; Tolerance: ±1%; Manufacturer Part Number: R0603_82R_1%_0.1W_100PPM; Case: 0603; Mounted: Yes; Sense: No; Socket: No; SMD: Yes; Manufacturer1 Example: NIC COMPONENT; Manufacturer1 ComponentHeight: 0.55mm; HelpURL: \\cern.ch\dfs\Applications\Altium\Datasheets\R0603_NIC_NRC.pdf; Author: CERN DEM JLC; CreateDate: 03.12.2007; LatestRevisionDate: 13.03.2008
R12 = R0603_180R_1%_0.1W_100PPM: Resistor - 1%; Part Description: General Purpose Thick Film Chip Resistor; Manufacturer: GENERIC; Manufacturer1 Part Number: NRC06F1800TRF; Power: 0.1W; TC: ±100ppm/°C; PressFit: No; Part Number: R0603_180R_1%_0.1W_100PPM; Component Kind: Standard; Component Type: Standard; Pin Count: 2; Value: 180; Status: Preferred; Tolerance: ±1%; Manufacturer Part Number: R0603_180R_1%_0.1W_100PPM; Case: 0603; Mounted: Yes; Sense: No; Socket: No; SMD: Yes; Manufacturer1 Example: NIC COMPONENT; Manufacturer1 ComponentHeight: 0.55mm; HelpURL: \\cern.ch\dfs\Applications\Altium\Datasheets\R0603_NIC_NRC.pdf; Author: CERN DEM JLC; CreateDate: 03.12.2007; LatestRevisionDate: 13.03.2008
R13 R15 = R0805_3R3_1%_0.125W_200PPM: Resistor - 1%; Part Description: General Purpose Thick Film Chip Resistor; Manufacturer: GENERIC; Manufacturer1 Part Number: 232273463308L or RC0805FR-073R3L; Power: 0.125W; TC: ±200ppm/°C; PressFit: No; Part Number: R0805_3R3_1%_0.125W_200PPM; Component Kind: Standard; Component Type: Standard; Pin Count: 2; Value: 3R3; Status: Preferred; Tolerance: ±1%; Manufacturer Part Number: R0805_3R3_1%_0.125W_200PPM; Case: 0805; Mounted: Yes; Sense: No; Socket: No; SMD: Yes; Manufacturer1 Example: YAGEO PHYCOMP; Manufacturer1 ComponentHeight: 0.65mm; HelpURL: \\cern.ch\dfs\Applications\Altium\Datasheets\R0805_Phycomp_RC0805.pdf; Author: CERN DEM JLC; CreateDate: 03.12.2007; LatestRevisionDate: 17.10.2012
R14 = R0603_51R_1%_0.1W_100PPM: Resistor - 1%; Part Description: General Purpose Thick Film Chip Resistor; Manufacturer: GENERIC; Manufacturer1 Part Number: NRC06F51R0TRF; Power: 0.1W; TC: ±100ppm/°C; PressFit: No; Part Number: R0603_51R_1%_0.1W_100PPM; Component Kind: Standard; Component Type: Standard; Pin Count: 2; Value: 51; Status: Preferred; Tolerance: ±1%; Manufacturer Part Number: R0603_51R_1%_0.1W_100PPM; Case: 0603; Mounted: Yes; Sense: No; Socket: No; SMD: Yes; Manufacturer1 Example: NIC COMPONENT; Manufacturer1 ComponentHeight: 0.55mm; HelpURL: \\cern.ch\dfs\Applications\Altium\Datasheets\R0603_NIC_NRC.pdf; Author: CERN DEM JLC; CreateDate: 03.12.2007; LatestRevisionDate: 13.03.2008
R17 R18 = R0603_510R_1%_0.1W_100PPM: Resistor - 1%; Part Description: General Purpose Thick Film Chip Resistor; Manufacturer: GENERIC; Manufacturer1 Part Number: CRCW0603510RFKEA; Power: 0.1W; TC: ±100ppm/°C; PressFit: No; Part Number: R0603_510R_1%_0.1W_100PPM; Component Kind: Standard; Component Type: Standard; Pin Count: 2; Value: 510; Status: Preferred; Tolerance: ±1%; Manufacturer Part Number: R0603_510R_1%_0.1W_100PPM; Case: 0603; Mounted: Yes; Sense: No; Socket: No; SMD: Yes; Manufacturer1 Example: VISHAY; Manufacturer1 ComponentHeight: 0.5mm; HelpURL: \\cern.ch\dfs\Applications\Altium\Datasheets\R0603_VISHAY_CRCW e3.pdf; Author: CERN DEM JLC; CreateDate: 03.12.2007; LatestRevisionDate: 21.03.2018
R19 R21-R23 = R0805_150R_1%_0.125W_100PPM: Resistor - 1%; Part Description: General Purpose Thick Film Chip Resistor; Manufacturer: GENERIC; Manufacturer1 Part Number: NRC10F1500TRF; Power: 0.125W; TC: ±100ppm/°C; PressFit: No; Part Number: R0805_150R_1%_0.125W_100PPM; Component Kind: Standard; Component Type: Standard; Pin Count: 2; Value: 150; Status: Preferred; Tolerance: ±1%; Manufacturer Part Number: R0805_150R_1%_0.125W_100PPM; Case: 0805; Mounted: Yes; Sense: No; Socket: No; SMD: Yes; Manufacturer1 Example: NIC COMPONENT; Manufacturer1 ComponentHeight: 0.6mm; HelpURL: \\cern.ch\dfs\Applications\Altium\Datasheets\R0805_NIC_NRC.pdf; Author: CERN DEM JLC; CreateDate: 03.12.2007; LatestRevisionDate: 13.03.2008
TR1 = XFMR_MINI-CIRCUITS_TC1-1-13M+: 50 Ohms 4.5 To 3000MHz RF Transformers; Part Number: XFMR_MINI-CIRCUITS_TC1-1-13M+; Component Kind: Standard; Component Type: Standard; Pin Count: 5; Value: 1:1; Status: None; Part Description: 50 Ohms 4.5 To 3000MHz RF Transformers; Manufacturer: MINI-CIRCUITS; Manufacturer Part Number: TC1-1-13M+; Mounted: Yes; Socket: No; SMD: Yes; ComponentHeight: 3.81mm; HelpURL: \\cern.ch\dfs\Applications\Altium\Datasheets\XFMR_MINI-CIRCUITS_TC1-1-13M+.pdf; Author: CERN DEM JLC; CreateDate: 2011-11-30; LatestRevisionDate: 2011-11-30; Table: Transformers